# EAGLE schematic 200429 eAR ECU MPS20 PX Sensor PTH R00 (EAGLE 7.6.0)
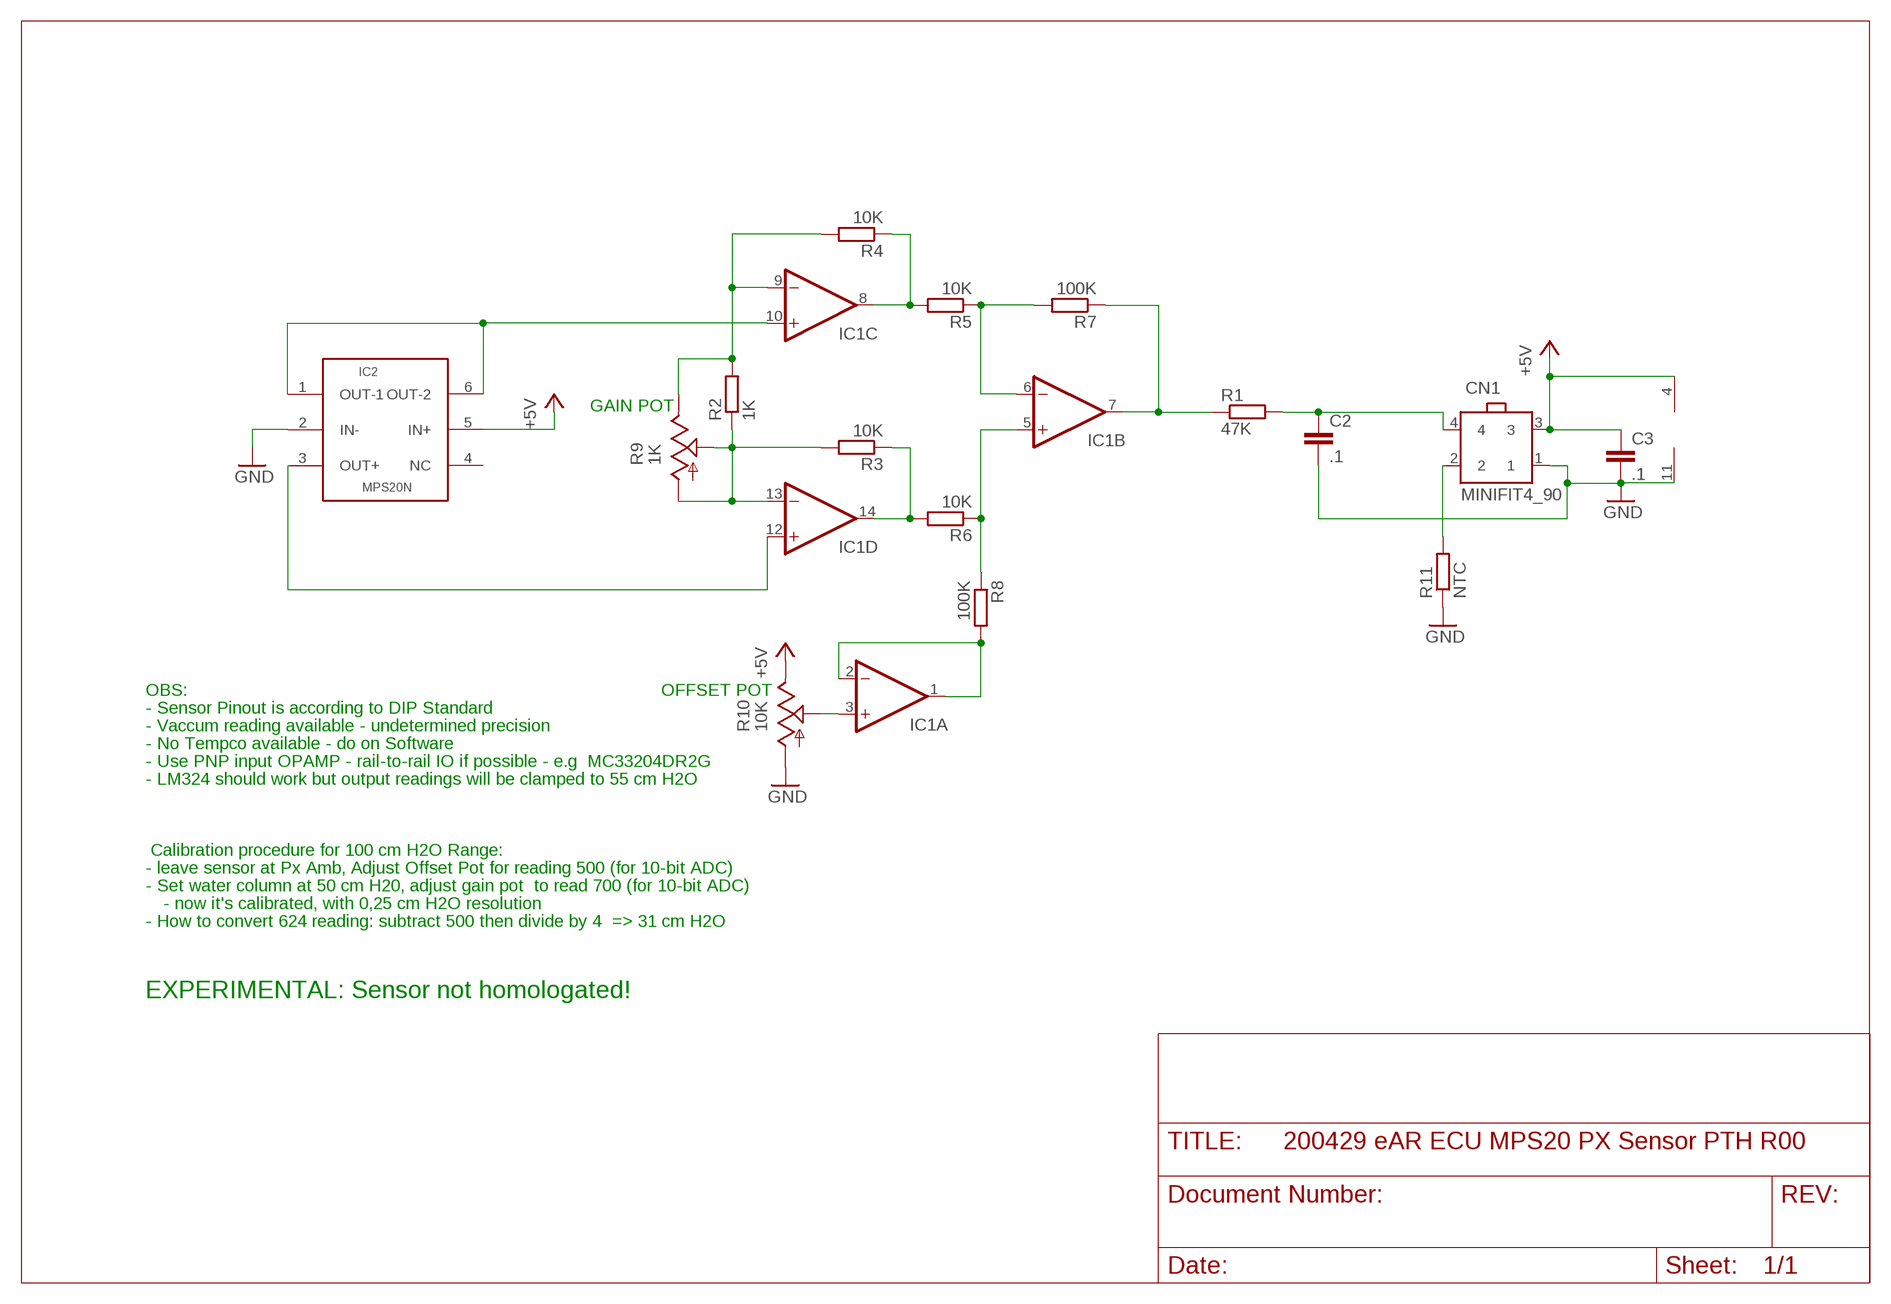
[diagram p0: schematic, sheet 1]

## Parts
C2  .1  C-EU050-025X075  [C050-025X075]
C3  .1  C-EU050-025X075  [C050-025X075]
CN1  MINIFIT4_90  [MINIFIT4_90]
IC1  LM324N  [DIL14]
IC2  MPS20N  [DIL6-WIDE]
R1  47K  R-EU_0207/10  [0207/10]
R2  1K  R-EU_0207/10  [0207/10]
R3  10K  R-EU_0207/10  [0207/10]
R4  10K  R-EU_0207/10  [0207/10]
R5  10K  R-EU_0207/10  [0207/10]
R6  10K  R-EU_0207/10  [0207/10]
R7  100K  R-EU_0207/10  [0207/10]
R8  100K  R-EU_0207/10  [0207/10]
R9  1K  TRIM_US-B64Y  [B64Y]
R10  10K  TRIM_US-B64Y  [B64Y]
R11  NTC  R-EU_R0805W  [R0805W]

## Nets
+5V: C3.1 CN1.3 IC1.4(P:V+) IC2.5(IN+) R10.E
GND: C2.2 C3.2 CN1.1 IC1.11(P:V-) IC2.2(IN-) R10.A R11.1
N$1: IC1.10(C:+IN) IC2.1(OUT-1) IC2.6(OUT-2)
N$2: C2.1 CN1.4 R1.2
N$3: IC1.12(D:+IN) IC2.3(OUT+)
N$4: IC1.9(C:-IN) R2.2 R4.2 R9.E
N$5: IC1.13(D:-IN) R2.1 R3.2 R9.A R9.S
N$6: IC1.7(B:OUT) R1.1 R7.1
N$7: IC1.8(C:OUT) R4.1 R5.2
N$8: IC1.14(D:OUT) R3.1 R6.2
N$9: IC1.3(A:+IN) R10.S
N$10: IC1.6(B:-IN) R5.1 R7.2
N$11: IC1.5(B:+IN) R6.1 R8.1
N$12: CN1.2 R11.2
N$13: IC1.1(A:OUT) IC1.2(A:-IN) R8.2
Unconnected: IC2.4(NC)

## Notes on the sheet
- GAIN POT
- OBS: | OFFSET POT
- - Sensor Pinout is according to DIP Standard
- - Vaccum reading available - undetermined precision
- - No Tempco available - do on Software
- - Use PNP input OPAMP - rail-to-rail IO if possible - e.g  MC33204DR2G
- - LM324 should work but output readings will be clamped to 55 cm H2O
- Calibration procedure for 100 cm H2O Range:
- - leave sensor at Px Amb, Adjust Offset Pot for reading 500 (for 10-bit ADC)
- - Set water column at 50 cm H20, adjust gain pot  to read 700 (for 10-bit ADC)
- - now it's calibrated, with 0,25 cm H2O resolution
- - How to convert 624 reading: subtract 500 then divide by 4  => 31 cm H2O
- EXPERIMENTAL: Sensor not homologated!

## Library data of the parts
C2 C3 = rcl:C-EU: CAPACITOR, European symbol
CN1 = FlexCustom:MINIFIT4_90
IC1 = linear:LM324: OP AMP
IC2 = FlexCustom:MPS20N
R1-R8 R11 = rcl:R-EU_: RESISTOR, European symbol
R9 R10 = pot:TRIM_US-: POTENTIOMETER